# EasyEDA Pro project ProProject_2024电赛备赛清单_Wang01_2024-08-05.epro, schematic Schematic1
Create Date: 2024-07-20; Page Name: P1; Project Name: 2024电赛备赛清单_Wang01; Schematic Name: Schematic1; Update Date: 2024-07-21; Company: 嘉立创EDA; Page Size: A4; Version: V1.0
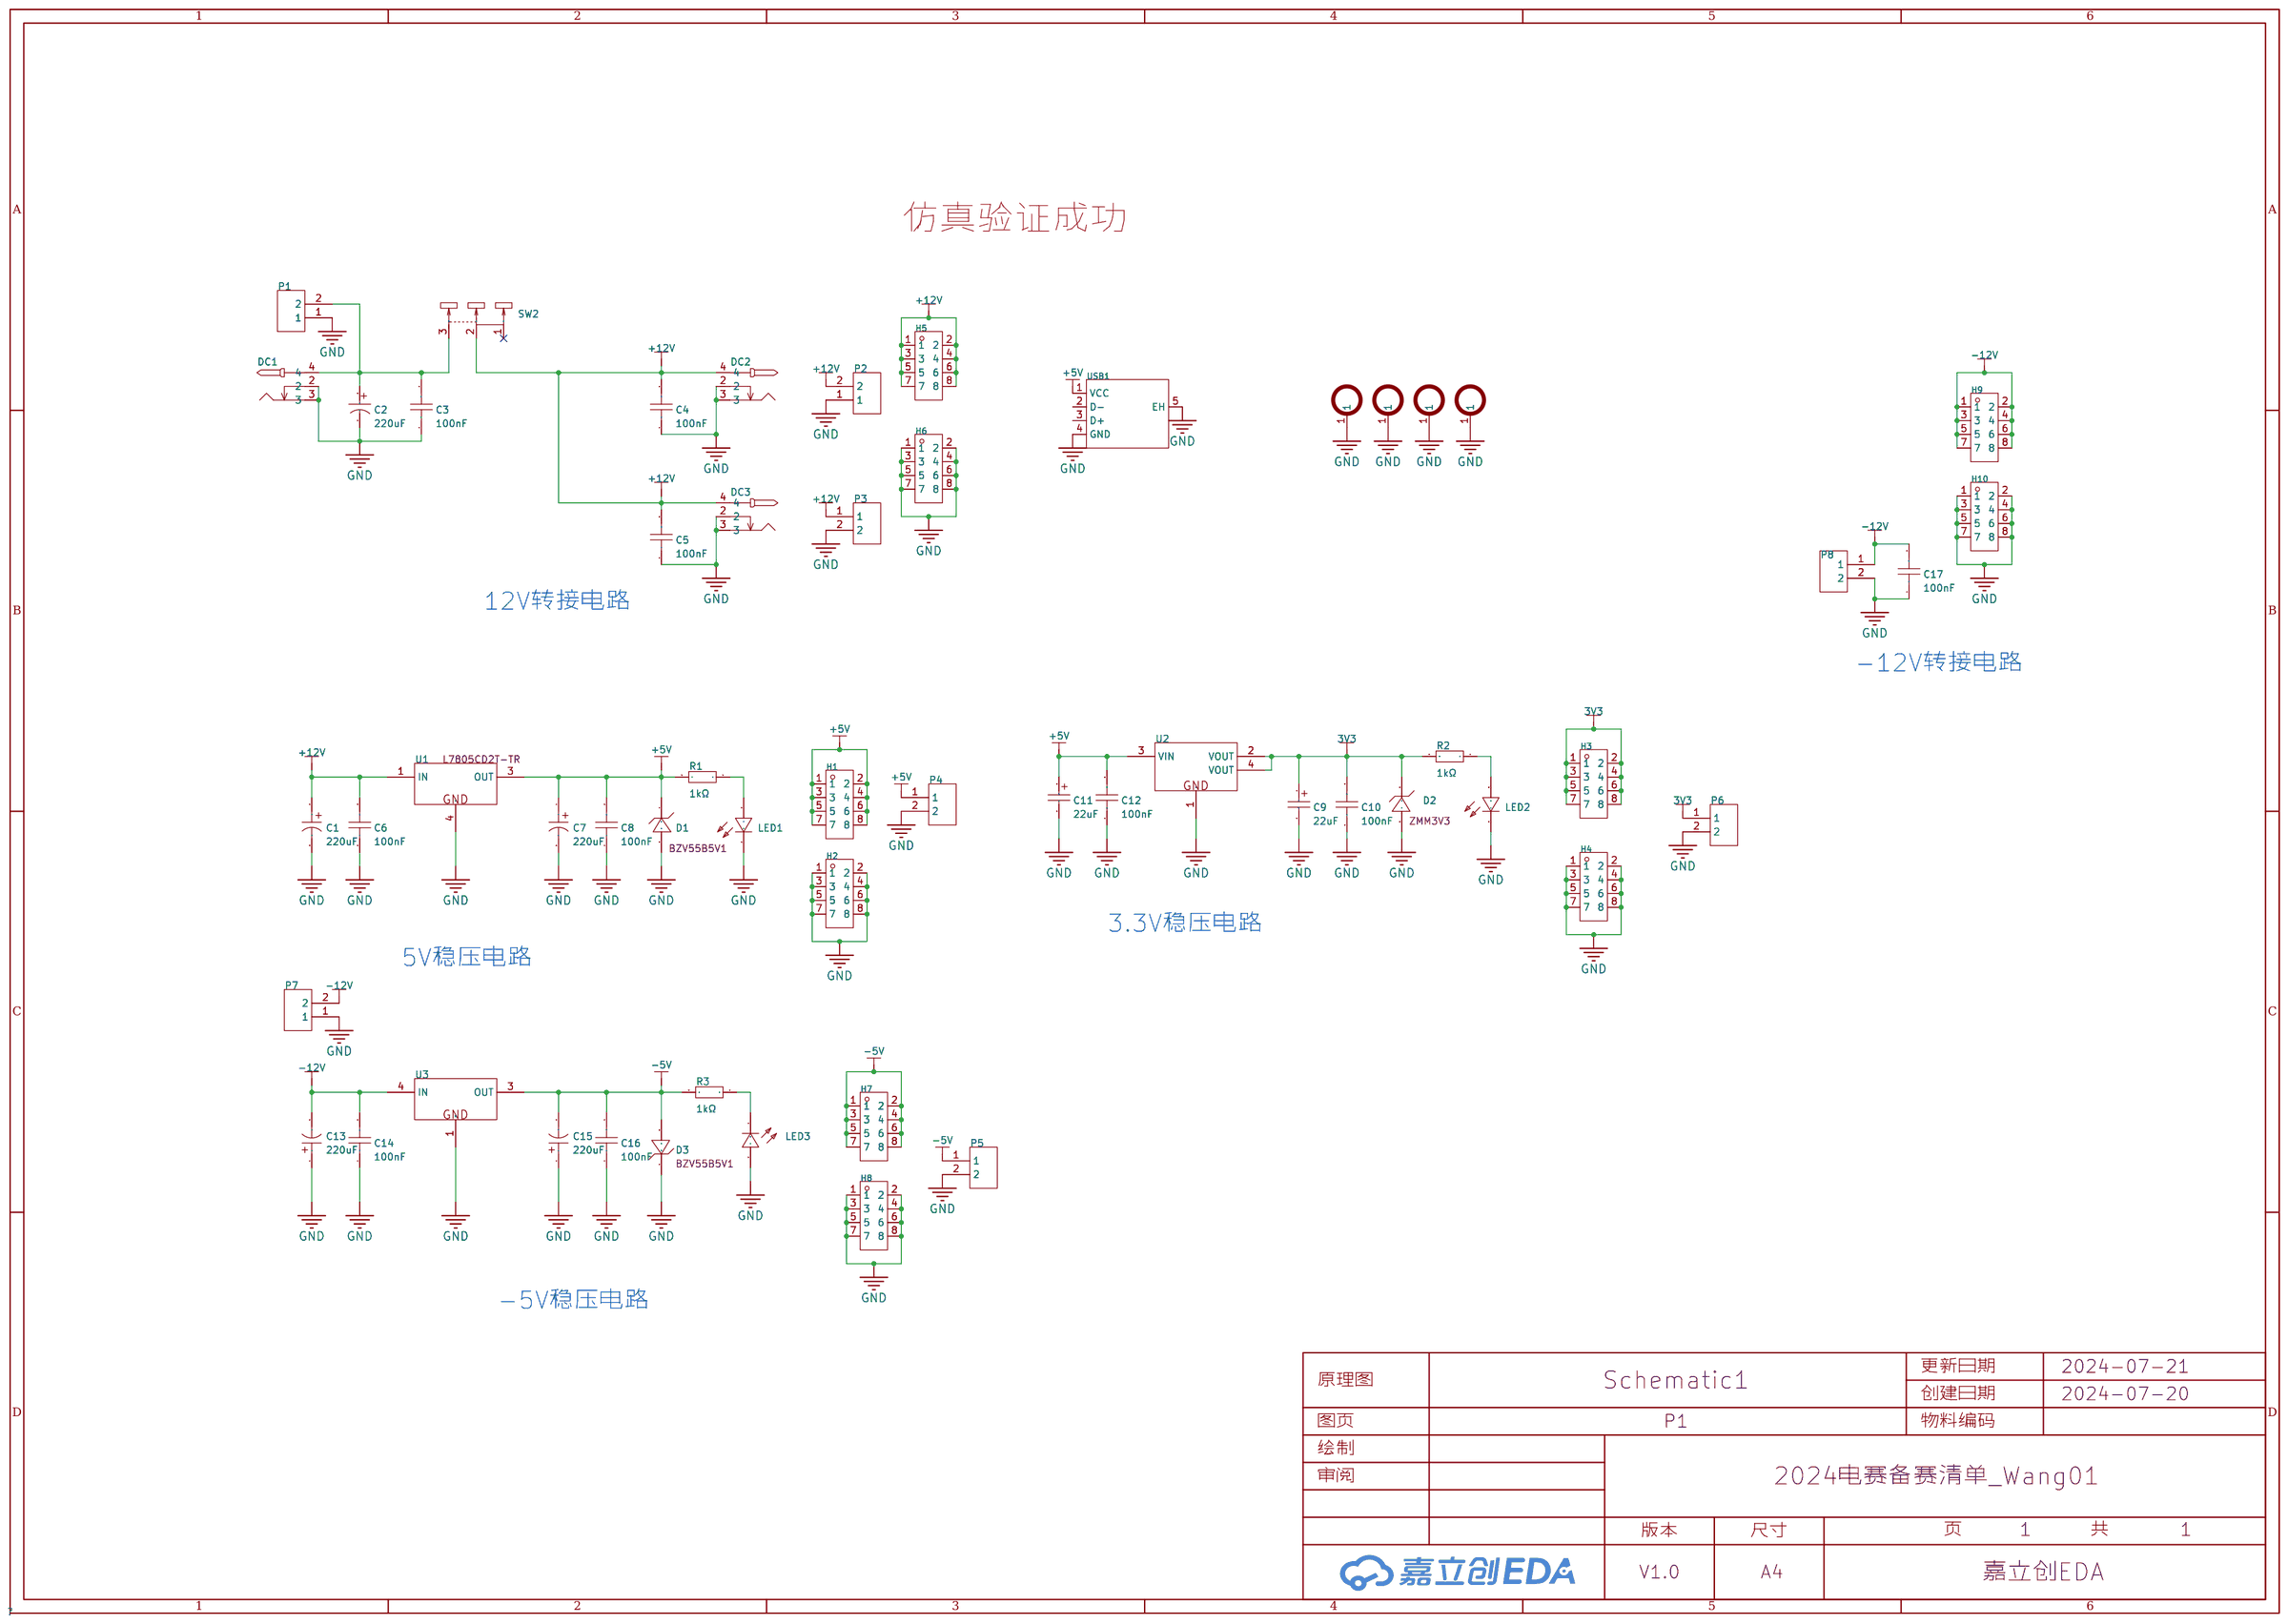
[diagram p0: schematic sheet]

## Parts
C1  220uF  [CAP-SMD_BD6.3-L6.6-W6.6-LS7.4-FD]
C2  220uF  [CAP-TH_BD8.0-P3.50-D0.6-FD]
C3  100nF  [CAP-TH_L8.5-W5.0-P5.00-D1.2]
C4  100nF  [C0603]
C5  100nF  [C0603]
C6  100nF  [C0603]
C7  220uF  [CAP-SMD_BD6.3-L6.6-W6.6-LS7.4-FD]
C8  100nF  [C0603]
C9  22uF  [CASE-B_3528]
C10  100nF  [C0603]
C11  22uF  [CASE-B_3528]
C12  100nF  [C0603]
C13  220uF  [CAP-SMD_BD6.3-L6.6-W6.6-LS7.4-FD]
C14  100nF  [C0603]
C15  220uF  [CAP-SMD_BD6.3-L6.6-W6.6-LS7.4-FD]
C16  100nF  [C0603]
C17  100nF  [C0603]
D1  BZV55B5V1  [SOD-80_L3.5-W1.5-RD]
D2  ZMM3V3  [LL-34_L3.5-W1.5-RD]
D3  BZV55B5V1  [SOD-80_L3.5-W1.5-RD]
DC1  DC-005 2.0  [DC-IN-TH_DC-5520-1]
DC2  DC-005 2.0  [DC-IN-TH_DC-5520-1]
DC3  DC-005 2.0  [DC-IN-TH_DC-5520-1]
H1  PZ254V-12-8P  [HDR-TH_8P-P2.54-V-M-R2-C4-S2.54]
H2  PZ254V-12-8P  [HDR-TH_8P-P2.54-V-M-R2-C4-S2.54]
H3  PZ254V-12-8P  [HDR-TH_8P-P2.54-V-M-R2-C4-S2.54]
H4  PZ254V-12-8P  [HDR-TH_8P-P2.54-V-M-R2-C4-S2.54]
H5  PZ254V-12-8P  [HDR-TH_8P-P2.54-V-M-R2-C4-S2.54]
H6  PZ254V-12-8P  [HDR-TH_8P-P2.54-V-M-R2-C4-S2.54]
H7  PZ254V-12-8P  [HDR-TH_8P-P2.54-V-M-R2-C4-S2.54]
H8  PZ254V-12-8P  [HDR-TH_8P-P2.54-V-M-R2-C4-S2.54]
H9  PZ254V-12-8P  [HDR-TH_8P-P2.54-V-M-R2-C4-S2.54]
H10  PZ254V-12-8P  [HDR-TH_8P-P2.54-V-M-R2-C4-S2.54]
J1  -  [M3固定孔]
J2  -  [M3固定孔]
J3  -  [M3固定孔]
J4  -  [M3固定孔]
LED1  NCD0603R1  [LED0603-RD_RED]
LED2  NCD0603R1  [LED0603-RD_RED]
LED3  NCD0603R1  [LED0603-RD_RED]
P1  WJ500V-5.08-2P  [CONN-TH_2P-P5.00_WJ500V-5.08-2P]
P2  WJ500V-5.08-2P  [CONN-TH_2P-P5.00_WJ500V-5.08-2P]
P3  WJ500V-5.08-2P  [CONN-TH_2P-P5.00_WJ500V-5.08-2P]
P4  WJ500V-5.08-2P  [CONN-TH_2P-P5.00_WJ500V-5.08-2P]
P5  WJ500V-5.08-2P  [CONN-TH_2P-P5.00_WJ500V-5.08-2P]
P6  WJ500V-5.08-2P  [CONN-TH_2P-P5.00_WJ500V-5.08-2P]
P7  WJ500V-5.08-2P  [CONN-TH_2P-P5.00_WJ500V-5.08-2P]
P8  WJ500V-5.08-2P  [CONN-TH_2P-P5.00_WJ500V-5.08-2P]
R1  1kΩ  [R0603]
R2  1kΩ  [R0603]
R3  1kΩ  [R0603]
SW2  SS-12D10L5  [SW-TH_SS-12D10L5]
U1  L7805CD2T-TR  [TO-263-2_L10.0-W9.1-P5.08-LS15.2-TL]
U2  -  [SOT-223-3_L6.5-W3.4-P2.30-LS7.0-BR]
U3  L7905CD2T-TR  [TO-263-2_L10.0-W9.1-P5.08-LS15.2-TL]
USB1  USB-226-BRY  [USB-A-TH_USB-226-BRY]

## Library data of the parts
C1 C7 C13 C15 = RVT1E221M0607: 容值:220uF;精度:±20%;额定电压:25V;纹波电流:150mA@120Hz;等效串联电阻:-;; LCSC Part Name: 220uF ±20% 25V; Supplier Part: C2918361; Manufacturer: ROQANG(容强); Supplier Footprint: SMD,D6.3xL7.7mm; Datasheet: https://atta.szlcsc.com/upload/public/pdf/source/20211118/497C0614266278696CA52BDF245B991F.pdf; Supplier: LCSC; Tolerance: ±20%; Rated Voltage: 25V; φD: 6.3mm; L: 7.7mm; Ripple Current: 150mA@120Hz; Operating Temperature: -40℃~+105℃
C2 = KM227M035F12RR0VH2FP0: 容值:220uF;精度:±20%;额定电压:35V;纹波电流:-;等效串联电阻:-;; LCSC Part Name: 220uF ±20% 35V; Supplier Part: C2063; Manufacturer: CX(承兴); Supplier Footprint: 插件,D8xL12mm; Datasheet: https://atta.szlcsc.com/upload/public/pdf/source/20211027/06D6BA3719C264B639DC286D935D03EA.pdf; Supplier: LCSC; Tolerance: ±20%; Rated Voltage: 35V; φD: 8mm; L: 12mm; Lead Spacing: 3.5mm; Lifetime @ Temp: 2000hrs@105℃
C3 = CT4-0805B104K500F3: 容值:100nF;精度:±10%;额定电压:50V;温度系数:X7R;; LCSC Part Name: 100nF ±10% 50V; Supplier Part: C84772; Manufacturer: FH(风华); Supplier Footprint: 插件,P=5.08mm; JLCPCB Part Class: 扩展库; Datasheet: https://atta.szlcsc.com/upload/public/pdf/source/20161024/1477288669695.pdf; Supplier: LCSC; Tolerance: ±10%; Voltage Rated: 50V; Temperature Coefficient: X7R
C4-C6 C8 C10 C12 C14 C16 C17 = CC0603KRX7R9BB104: 容值:100nF;精度:±10%;额定电压:50V;材质(温度系数):X7R;; LCSC Part Name: 100nF ±10% 50V; Supplier Part: C14663; Manufacturer: YAGEO(国巨); Supplier Footprint: 0603; Datasheet: https://atta.szlcsc.com/upload/public/pdf/source/20180910/C282072_33301C7F631E79921B82A8DAC6BCC5B3.pdf; Supplier: LCSC; Tolerance: ±10%; Voltage Rated: 50V; Temperature Coefficient: X7R
C9 C11 = TAJB226K016RNJ: 容值:22uF;精度:±10%;额定电压:16V;等效串联电阻:2.3Ω@100kHz;工作温度:-55℃~+125℃;; LCSC Part Name: 22uF ±10% 16V; Supplier Part: C8020; Manufacturer: Kyocera AVX; Datasheet: https://atta.szlcsc.com/upload/public/pdf/source/20160107/1457707749964.pdf; Supplier: LCSC; Tolerance: ±10%; Rated Voltage: 16V; Equivalent Series Resistance(ESR): 2.3Ω@100kHz; Operating Temperature: -55℃~+125℃
D1 D3 = BZV55B5V1: 二极管配置:独立式;稳压值(标称值):-;稳压值(范围):5V~5.2V;精度:-;功率:500mW;反向电流(Ir):100nA@1V;阻抗(Zzt):35Ω;; LCSC Part Name: 500mW; Supplier Part: C545327; Manufacturer: LGE(鲁光); Supplier Footprint: SOD-80; Datasheet: https://atta.szlcsc.com/upload/public/pdf/source/20200521/C545327_60D3A6779D4B17AB00B9D32EC53EDD92.pdf; Supplier: LCSC; Diode Configuration: 独立式; Zener Voltage (Range): 5V~5.2V; Power Dissipation: 500mW; Reverse Leakage Current (Ir): 100nA@1V; Zener Impedance (Zzt): 35Ω
D2 = ZMM3V3-M: 二极管配置:独立式;稳压值(标称值):3.3V;稳压值(范围):3.1V~3.5V;精度:-;功率:500mW;反向电流(Ir):2uA@1V;阻抗(Zzt):85Ω;; LCSC Part Name: 3.3V 500mW; Supplier Part: C8056; Manufacturer: ST(先科); Supplier Footprint: LL-34; Datasheet: https://atta.szlcsc.com/upload/public/pdf/source/20120512/1457706507365.pdf; Supplier: LCSC; Diode Configuration: 独立式; Zener Voltage (Nom): 3.3V; Zener Voltage (Range): 3.1V~3.5V; Power Dissipation: 500mW; Reverse Leakage Current (Ir): 2uA@1V; Zener Impedance (Zzt): 85Ω
DC1-DC3 = DC-005 2.0: 连接器类型:DC电源插座;安装方式:弯插;触点内径:2mm;触点外径:6.4mm;额定电流:-;额定电压:-;工作温度范围:-;; LCSC Part Name: DC电源插座 内径:2mm 外径:6.4mm 铁材质; Supplier Part: C16214; Manufacturer: BOOMELE(博穆精密); Supplier Footprint: 插件; JLCPCB Part Class: Extended Part; Datasheet: https://atta.szlcsc.com/upload/public/pdf/source/20190827/C16214_DA59F99E888FED58D9833F5341D610B0.pdf; Supplier: LCSC; Connector Type: DC电源插座; Mounting Style: 弯插; Inside Contact Diameter: 2mm; Outside Contact Diameter: 6.4mm
H1-H10 = PZ254V-12-8P: 排数:双排;总PIN位数:8P;间距:2.54mm;插针结构:2x4P;行距:2.54mm;安装类型:直插;圆针/方针:方针;额定电流:-;额定电压:-;配合针长度:6mm;塑高:2.5mm;端接针长度:3mm;触头材质:黄铜;触头镀层:-;工作温度范围:-40℃~+105℃;颜色:黑色;; LCSC Part Name: 2.54mm 2x4P 直插 方针; Supplier Part: C492421; Manufacturer: XFCN(兴飞); Supplier Footprint: 插件,P=2.54mm; Datasheet: https://atta.szlcsc.com/upload/public/pdf/source/20200309/C492421_DC8A206AF99CD7755BD4A5B0BC48200B.pdf; Supplier: LCSC; Number of Rows: 双排; Number of Pins: 8P; Pitch: 2.54mm; Pin Structure: 2x4P; Row Spacing: 2.54mm; Mounting Type: 直插; Circluar Pins/Square Pins: 方针; Length of Mating Pin: 6mm; Insulation Height: 2.5mm; Length of End Connection Pin: 3mm; Contact Material: 黄铜; Operating Temperature Range: -40℃~+105℃; Color: 黑色
J1-J4 = M3-固定孔
LED1-LED3 = NCD0603R1_C84263: 发光颜色:红灯;; LCSC Part Name: 红灯; Supplier Part: C84263; Manufacturer: 国星光电; Supplier Footprint: 0603; Datasheet: https://atta.szlcsc.com/upload/public/pdf/source/20200820/C84263_DABC6A75E58F576973B407FDBA283D60.pdf; Supplier: LCSC; Emitted Color: 红灯
P1-P8 = WJ500V-5.08-2P: 间距:5.08mm;结构:1x2P;排数:1;每排PIN数:2;安装方式:直针;额定电流:18A;额定电压:250V;线规 - AWG:14~30;线规 - mm2:2.5;工作温度范围:-40℃~+105℃;颜色:绿色;; LCSC Part Name: 5.08mm 1x2P 排数:1 每排P数:2 直针 可拼接; Supplier Part: C8465; Manufacturer: KANGNEX(康奈克斯电气); Supplier Footprint: 插件,P=5.08mm; JLCPCB Part Class: 扩展库; Datasheet: https://atta.szlcsc.com/upload/public/pdf/source/20191225/C8465_02D34CE5B5B4A53DF5891601D97FA9F4.pdf; Supplier: LCSC; Pitch: 5.08mm; Structure: 1x2P; Number of Rows: 1; Number of PINs Per Row: 2; Mounting Style: 直针; Current Rating (Max): 18A; Voltage Rating (Max): 250V; Wire Gauge - AWG: 14~30; Wire Gauge - mm2: 2.5; Operating Temperature Range: -40℃~+105℃; Color: 绿色
R1-R3 = 0603WAF1001T5E: 电阻类型:厚膜电阻;阻值:1kΩ;精度:±1%;功率:100mW;; LCSC Part Name: 1kΩ ±1% 100mW; Supplier Part: C21190; Manufacturer: UNI-ROYAL(厚声); Supplier Footprint: 0603; Datasheet: https://atta.szlcsc.com/upload/public/pdf/source/20200306/C422600_1E6D84923E4A46A82E41ADD87F860B5C.pdf; Supplier: LCSC; Type: 厚膜电阻; Tolerance: ±1%; Power(Watts): 100mW; Temperature Coefficient: ±100ppm/℃; Overload Voltage (Max): 75V; Operating Temperature Range: -55℃~+155℃
SW2 = SS-12D10L5: 额定电流(DC):3A;额定电压(DC):125V;额定电流(AC):3A;额定电压(AC):125V;电路结构:单刀双掷;安装方式:直插;机械寿命:1万次;开关颜色:黑色;; LCSC Part Name: 柄长5mm 直插双档 滑动开关 大电流; Supplier Part: C319012; Manufacturer: XKB Connectivity(中国星坤); Supplier Footprint: 插件; JLCPCB Part Class: 扩展库; Datasheet: https://atta.szlcsc.com/upload/public/pdf/source/20211009/D6412F37AABE6F9459A6EE7FA4DAEADB.pdf; Supplier: LCSC; Current Rating (DC): 3A; Voltage Rating (DC): 125V; Current Rating (AC): 3A; Voltage Rating (AC): 125V; Circuit: 单刀双掷; Mounting Style: 直插; Mechanical Life: 1万次; Actuator Color: 黑色; Actuator Style: 矩形柱状; Pin Style: PC引脚; Operating Temperature: -40℃~+85℃; Switch Length: 13mm; Switch Width: 6.8mm; Switch Height: 6.4mm
U1 = L7805CD2T-TR: 输出类型:固定;输出极性:正;最大输入电压:35V;输出电压:5V;输出电流:1.5A;电源纹波抑制比(PSRR):62dB@(120Hz);; LCSC Part Name: 输入35V 输出5V 1.5A; Supplier Part: C15077; Manufacturer: ST(意法半导体); Supplier Footprint: TO-263; Datasheet: https://atta.szlcsc.com/upload/public/pdf/source/20191219/C472632_C0855675BBC73B8C8E44EE1325AAD56A.pdf; Supplier: LCSC; Output Type: 固定; Output Polarity: 正; Number of Outputs: 1; Maximum Input Voltage: 35V; Output Voltage: 5V; Dropout Voltage: 2V@(1A); Output Current: 1.5A; Power Supply Rejection Ratio (PSRR): 62dB@(120Hz)
U2 = AMS1117-3.3_C6186: 输出类型:固定;输出极性:正;最大输入电压:-;输出电压:3.3V;输出电流:1A;电源纹波抑制比(PSRR):72dB@(120Hz);
U3 = L7905CD2T-TR: 输出类型:固定;输出极性:负;最大输入电压:35V;输出电压:5V;输出电流:1.5A;电源纹波抑制比(PSRR):60dB@(120Hz);; LCSC Part Name: 输入35V 输出5V 1.5A; Supplier Part: C28684; Manufacturer: ST(意法半导体); Supplier Footprint: TO-263; JLCPCB Part Class: 扩展库; Datasheet: https://atta.szlcsc.com/upload/public/pdf/source/20140319/1457707026146.pdf; Supplier: LCSC; Output Type: 固定; Output Polarity: 负; Number of Outputs: 1; Maximum Input Voltage: 35V; Output Voltage: 5V; Dropout Voltage: 1.4V@(1A); Output Current: 1.5A; Power Supply Rejection Ratio (PSRR): 60dB@(120Hz)
USB1 = USB-226-BRY: 连接器类型:Type-A;标准:USB 2.0;公母:母座;触点数量:4;端口数量:1;安装方式:侧插;额定电流 - 电源:1.5A;工作温度范围:-20℃~+70℃;焊接温度(最大值):260℃;; LCSC Part Name: Type-A 母座 侧插 卷边 铁壳; Supplier Part: C720523; Manufacturer: XUNPU(讯普); Supplier Footprint: 插件; JLCPCB Part Class: 扩展库; Supplier: LCSC; Connector Type: Type-A; Standard: USB 2.0; Gender: 母座; Number of Contacts: 4; Number of Ports: 1; Mounting Style: 侧插; Current Rating - Power (Max): 1.5A; Operating Temperature Range: -20℃~+70℃; Welding Temperature (Max): 260℃

## Nets
3V3: C9.1 C10.2 D2.1(C) H3.1 H3.2 H3.3 H3.4 H3.5 H3.6 H3.7 H3.8 P6.1 R2.2 U2.2(VOUT) U2.4(VOUT)
+5V: C7.1 C8.2 C11.1 C12.2 D1.1(C) H1.1 H1.2 H1.3 H1.4 H1.5 H1.6 H1.7 H1.8 P4.1 R1.2 U1.3(OUT) U2.3(VIN) USB1.1(VCC)
+12V: C1.1 C4.2 C5.2 C6.2 DC2.4 DC3.4 H5.1 H5.2 H5.3 H5.4 H5.5 H5.6 H5.7 H5.8 P2.2 P3.1 SW2.2 U1.1(IN)
-5V: C15.2 C16.2 D3.2(A) H7.1 H7.2 H7.3 H7.4 H7.5 H7.6 H7.7 H7.8 P5.1 R3.2 U3.3(OUT)
-12V: C13.2 C14.2 C17.2 H9.1 H9.2 H9.3 H9.4 H9.5 H9.6 H9.7 H9.8 P7.2 P8.1 U3.4(IN)
GND: C1.2 C2.2 C3.1 C4.1 C5.1 C6.1 C7.2 C8.1 C9.2 C10.1 C11.2 C12.1 C13.1 C14.1 C15.1 C16.1 C17.1 D1.2(A) D2.2(A) D3.1(C) DC1.2 DC1.3 DC2.2 DC2.3 DC3.2 DC3.3 H2.1 H2.2 H2.3 H2.4 H2.5 H2.6 H2.7 H2.8 H4.1 H4.2 H4.3 H4.4 H4.5 H4.6 H4.7 H4.8 H6.1 H6.2 H6.3 H6.4 H6.5 H6.6 H6.7 H6.8 H8.1 H8.2 H8.3 H8.4 H8.5 H8.6 H8.7 H8.8 H10.1 H10.2 H10.3 H10.4 H10.5 H10.6 H10.7 H10.8 J1.1 J2.1 J3.1 J4.1 LED1.1(K) LED2.1(K) LED3.2(A) P1.1 P2.1 P3.2 P4.2 P5.2 P6.2 P7.1 P8.2 U1.4(GND) U2.1(GND) U3.1(GND) USB1.4(GND) USB1.5(EH)
$1N2333: LED1.2(A) R1.1
$1N2512: LED2.2(A) R2.1
$1N4406: C2.1 C3.2 DC1.4 P1.2 SW2.3
$1N4784: LED3.1(K) R3.1

Not connected (* = marked no-connect by the designer): SW2 1*; USB1 2(D-) 3(D+)

## Notes on the sheet
- 仿真验证成功
- 12V转接电路
- -12V转接电路
- 3.3V稳压电路
- 5V稳压电路
- -5V稳压电路
